# Altium schematic sheet 4_POW.schdoc.schdoc
size 309 x 223 mm; Symbol: Sheet-Symbol_A4; Device: Sheet-Symbol_A4; @Page Name: POW.Schematic1; @Create Date: 2023-10-28; @Page Count: 4; @Page No: 3; @Project Name: New Project_2023-10-25_23-03-02; @Schematic Name: Schematic1; @Update Date: 2023-11-27; Company: 嘉立创EDA; Page Size: A4; Version: V1.0; SheetNumber: 1; SheetTotal: 4
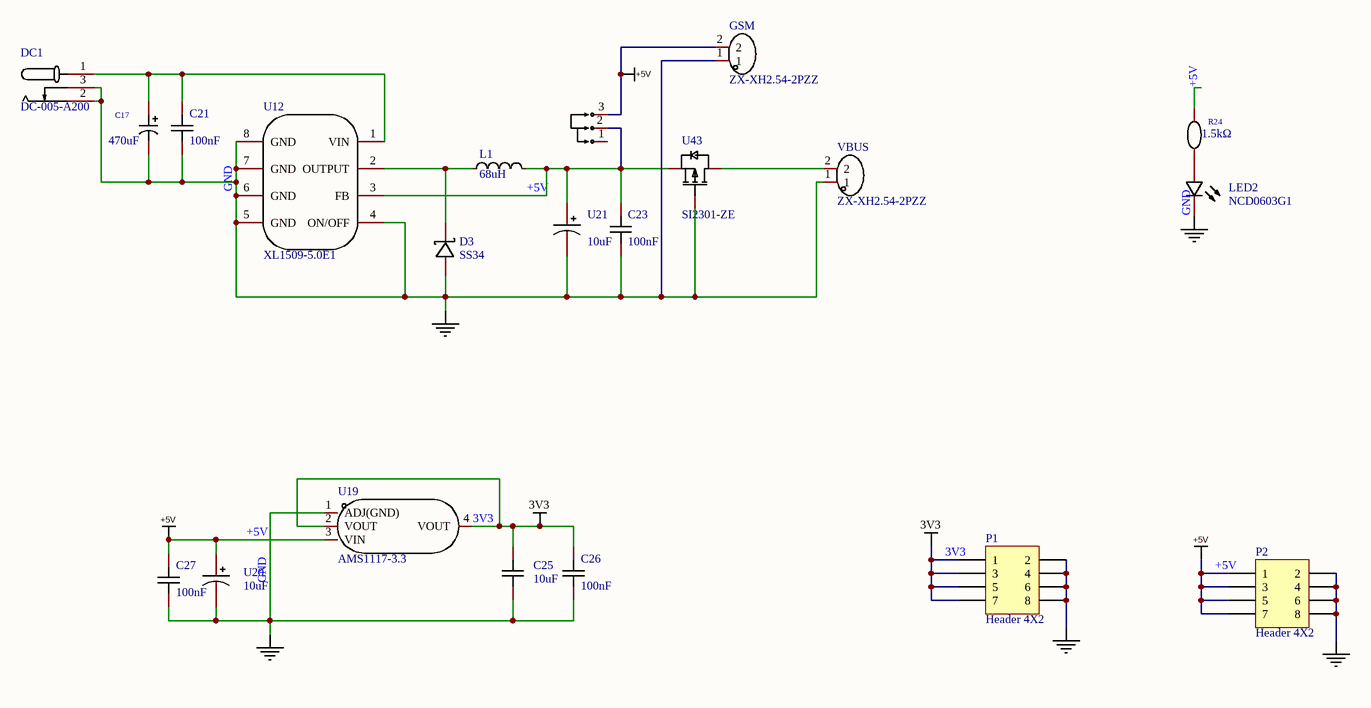
[diagram p0: 4_POW.schdoc.schdoc]

## Parts
C17  470uF  [CAP-SMD_BD6.3-L6.6-W6.6-LS7.6-RD]
C21  100nF  [C0603]
C23  100nF  [C0603]
C25  10uF  [C0603]
C26  100nF  [C0603]
C27  100nF  [C0603]
D3  SS34  [SMA_L4.3-W2.6-LS5.0-RD]
DC1  DC-005-A200  [DC-IN-TH_DC-005-A200]
GSM  ZX-XH2.54-2PZZ  [CONN-TH_2P-P2.50_HX25003-2A]
L1  68uH  [IND-SMD_L6.0-W6.0_SWPA6045S]
LED2  NCD0603G1  [LED0603-RD]
P1  Header 4X2  [HDR2X4]
P2  Header 4X2  [HDR2X4]
R24  1.5kΩ  [R0603]
SW??  SS12D10G4 071  [3PINSW]  (value not drawn)
U12  XL1509-5.0E1  [SOIC-8_L5.0-W4.0-P1.27-LS6.0-BL]
U19  AMS1117-3.3  [SOT-223-3_L6.5-W3.4-P2.30-LS7.0-BR]
U20  10uF  [CAP-TH_BD6.3-P2.50-D0.5-FD]
U21  10uF  [CAP-TH_BD6.3-P2.50-D0.5-FD]
U43  SI2301-ZE  [SOT-23-3_L2.9-W1.3-P1.90-LS2.4-BR]
VBUS  ZX-XH2.54-2PZZ  [CONN-TH_2P-P2.50_HX25003-2A]

## Nets
3V3: C25.2 C26.2 P1.1 P1.3 P1.5 P1.7 U19.2(VOUT) U19.4(VOUT)
+5V: C23.2 C27.2 GSM.2 L1.2 P2.1 P2.3 P2.5 P2.7 R24.2 SW??.2 SW??.3 U12.3(FB) U19.3(VIN) U20.1 U21.1 U43.2(S)
GND: C17.2 C21.1 C23.1 C25.1 C26.1 C27.1 D3.2(A) DC1.2 DC1.3 GSM.1 LED2.1(K) P1.2 P1.4 P1.6 P1.8 P2.2 P2.4 P2.6 P2.8 U12.4(ON/OFF) U12.5(GND) U12.6(GND) U12.7(GND) U12.8(GND) U19.1(ADJ(GND)) U20.2 U21.2 U43.1(G) VBUS.1
NetC17_1: C17.1 C21.2 DC1.1 U12.1(VIN)
NetD3_1: D3.1(K) L1.1 U12.2(OUTPUT)
NetLED2_2: LED2.2(A) R24.1
NetU43_3: U43.3(D) VBUS.2

Not connected (* = marked no-connect by the designer): SW?? 1

## Notes on the sheet
- 1
- 2
- 3
- 4
- 5
- 6
- A
- B
- C
- 原理图
- Schematic1
- 创建日期
- 更新日期
- 2023-10-28
- 2023-11-27
- 审阅
- 绘制
- 图页
- POW.Schematic1
- 物料编码
- New Project_2023-10-25_23-03-02
- D
- 版本
- 尺寸
- 页
- 共
- V1.0
- A4
- 嘉立创EDA

## Library data of the parts
C17 = RVT1C471M0607: 容值:470uF;精度:±20%;额定电压:16V;电容体直径:6.3mm;电容体长度:7.7mm;工作寿命:2000hrs@105℃;工作温度:-55℃~+105℃;; Manufacturer: ROQANG(容强); Add into BOM: yes; Tolerance: ±20%; Rated Voltage: 16V; φD: 6.3mm; L: 7.7mm; Name: 470uF; Symbol: RVT1C471M0607; Device: RVT1C471M0607; LCSC Part Name: 470uF ±20% 16V; Supplier Part: C2977552; Manufacturer Part: RVT1C471M0607; Supplier Footprint: SMD,6.3x7.7mm; JLCPCB Part Class: 扩展库; Supplier: LCSC; Convert to PCB: yes; Value: 470uF; Lifetime @ Temp: 2000hrs@105℃; Operating Temperature: -55℃~+105℃
C21 C23 C26 C27 = CGA3E3X8R1H104M080AE: 容值:100nF;精度:±20%;额定电压:50V;材质(温度系数):X8R;; Manufacturer: TDK; Add into BOM: yes; Tolerance: ±20%; Voltage Rated: 50V; Temperature Coefficient: X8R; Name: 100nF; Symbol: CGA3E3X8R1H104M080AE; Device: CGA3E3X8R1H104M080AE; LCSC Part Name: 100nF ±20% 50V; Supplier Part: C3855738; Manufacturer Part: CGA3E3X8R1H104M080AE; Supplier Footprint: 0603; Supplier: LCSC; Convert to PCB: yes; Value: 100nF
C25 = C1608X6S0J106M080AC: 容值:10uF;精度:±20%;额定电压:6.3V;材质(温度系数):X6S;; Manufacturer: TDK; Symbol: C1608X6S0J106M080AC_C314596-1; Add into BOM: yes; Tolerance: ±20%; Voltage Rated: 6.3V; Temperature Coefficient: X6S; Name: 10uF; Device: C1608X6S0J106M080AC; LCSC Part Name: 10uF ±20% 6.3V; Supplier Part: C314596; Manufacturer Part: C1608X6S0J106M080AC; Supplier Footprint: 0603; Datasheet: https://atta.szlcsc.com/upload/public/pdf/source/20221212/519F8C46C56E78A46759B3245CB4AD37.pdf; Supplier: LCSC; Convert to PCB: yes; Value: 10uF
D3 = SS34: Symbol: SS34_C9900023345; Add into BOM: yes; Name: SS34; Device: SS34; LCSC Part Name: SS34; Supplier Part: C9900023345; Manufacturer Part: SS34; Supplier Footprint: SMA,DO-214AC; JLCPCB Part Class: 扩展库; Datasheet: 2022-07-04/534833A/5ff3008f79ea4c6ab22b1f3463cee262/20210714020425519.pdf; Supplier: LCSC; Convert to PCB: yes
DC1 = DC-005-A200: DC-005 外径6.4 内芯2.0 3A电流 DC电源插座; Manufacturer: XUNPU(讯普); Add into BOM: yes; Name: DC-005-A200; Symbol: DC-005-A200; Device: DC-005-A200; LCSC Part Name: DC-005-A200; Supplier Part: C720557; Manufacturer Part: DC-005-A200; Supplier Footprint: 14×9.0×11.0mm; JLCPCB Part Class: 扩展库; Datasheet: https://atta.szlcsc.com/upload/public/pdf/source/20200812/C720557_2286DFCD6C75B71AF905731F627ABF3A.pdf; Supplier: LCSC; Convert to PCB: yes
GSM VBUS = ZX-XH2.54-2PZZ: 参考系列:XH;间距:2.54mm;插针结构:1x2P;排数:1;每排PIN数:2;行距:-;公母:公型插针;安装方式:直插;额定电流:3A;触头材质:黄铜;触头镀层:锡;工作温度范围:-25℃~+85℃;焊接温度(最大值):260℃;; Manufacturer: Megastar(兆星); Add into BOM: yes; Reference Series: XH; Pitch: 2.54mm; Pins Structure: 1x2P; Number of PINs Per Row: 2; Gender: 公型插针; Current Rating (Max): 3A; Welding Temperature (Max): 260℃; Name: ZX-XH2.54-2PZZ; Symbol: ZX-XH2.54-2PZZ; Device: ZX-XH2.54-2PZZ; LCSC Part Name: 系列:XH 间距:2.54mm 1x2P 直插; Supplier Part: C7429632; Manufacturer Part: ZX-XH2.54-2PZZ; Supplier Footprint: 插件,P=2.54mm; JLCPCB Part Class: 扩展库; Datasheet: https://atta.szlcsc.com/upload/public/pdf/source/20230619/19BA6947230AA44A04D3EDD65E618FD0.pdf; Supplier: LCSC; Convert to PCB: yes; Number of Rows: 1; Row Spacing: -; Mounting Style: 直插; Contact Material: 黄铜; Contact Plating: 锡; Operating Temperature Range: -25℃~+85℃
L1 = SWPA6045S680MT: 类型:-;电感值:68uH;精度:±20%;额定电流:1A;饱和电流(Isat):1.2A;; Manufacturer: Sunlord(顺络); Add into BOM: yes; Tolerance: ±20%; Rated Current: 1A; Saturation Current (Isat): 1.2A; DC Resistance (DCR): 289mΩ; Name: 68uH; Symbol: SWPA6045S680MT; Device: SWPA6045S680MT; LCSC Part Name: 68uH ±20% 1.2A; Supplier Part: C53663; Manufacturer Part: SWPA6045S680MT; Supplier Footprint: SMD; JLCPCB Part Class: 扩展库; Datasheet: https://atta.szlcsc.com/upload/public/pdf/source/20210916/AC798BA7E846B7D0B6818F45CD84DB0B.pdf; Supplier: LCSC; Convert to PCB: yes; Type: -; Value: 68uH; Ratings: -
LED2 = NCD0603G1: 发光颜色:翠绿色;功率:72mW;透镜颜色:无色透明;主波长:515nm~530nm;发光强度:330mcd~900mcd;发光角度:130°;工作温度:-30℃~+85℃;; Manufacturer: 国星光电; Symbol: FC-D1608UGK-520D10; Add into BOM: yes; Emitted Color: 翠绿色; Forward Voltage (VF): 2.6V~3.6V; Forward Current: 10mA; Power Dissipation: 72mW; Lens Color: 无色透明; Viewing Angle: 130°; Name: NCD0603G1; Device: NCD0603G1; LCSC Part Name: 翠绿 0603翠绿  正贴; Supplier Part: C84267; Manufacturer Part: NCD0603G1; Supplier Footprint: 0603; JLCPCB Part Class: 扩展库; Datasheet: https://atta.szlcsc.com/upload/public/pdf/source/20200820/C84267_04BA7703640BAC111D09F5EFB971FBF3.pdf; Supplier: LCSC; Convert to PCB: yes; Dominant Wavelength: 515nm~530nm; Luminous Intensity: 330mcd~900mcd; Operating Temperature: -30℃~+85℃
P1 P2 = Header 4X2: Header, 4-Pin, Dual row; LatestRevisionDate: 17-Jul-2002; LatestRevisionNote: Re-released for DXP Platform.; Publisher: Altium Limited
R24 = SCR0603F1K: 阻值:1.5kΩ;精度:±1%;; Manufacturer: VO(翔胜); Name: Value; Add into BOM: yes; Value: 1kΩ; Tolerance: ±1%; Symbol: SCR0603F1K; Device: SCR0603F1K; LCSC Part Name: 1kΩ ±1%; Supplier Part: C3016283; Manufacturer Part: SCR0603F1K; Supplier Footprint: 0603; JLCPCB Part Class: 扩展库; Datasheet: https://atta.szlcsc.com/upload/public/pdf/source/20220513/247AF9639BA21CF93567DC289CCC6A22.pdf; Supplier: LCSC; Convert to PCB: yes
SW?? = SS12D10G4 071: Manufacturer: SHOU HAN(首韩); Add into BOM: yes; Circuit: 单刀双掷; Pin Style: PC引脚; Switch Length: 12.7mm; Switch Width: 6.7mm; Switch Height: 6.4mm; Current Rating (DC): 2A; Voltage Rating (DC): 125V; Mechanical Life: 3千次; Symbol: SS12D10G4 071; Device: SS12D10G4 071; Supplier: LCSC; Supplier Part: C2887259; Manufacturer Part: SS12D10G4 071; JLCPCB Part Class: Extended Part; LCSC Part Name: SS12D10G4 071; Supplier Footprint: 插件; Datasheet: https://atta.szlcsc.com/upload/public/pdf/source/20210820/80D1704BBF3FCEE0435FCAA54C61E0A3.pdf; Convert to PCB: yes; Actuator Style: -; Mounting Style: 立插; Actuator Color: -; Current Rating (AC): -; Voltage Rating (AC): -; Operating Temperature: -16℃~+60℃
U12 = XL1509-5.0E1: 功能类型:降压型;输入电压:-;输出电流(最大值):-;; Manufacturer: XLSEMI(芯龙); Add into BOM: yes; Function: 降压型; Name: XL1509-5.0E1; Symbol: XL1509-5.0E1; Device: XL1509-5.0E1; LCSC Part Name: XL1509-5.0E1; Supplier Part: C61063; Manufacturer Part: XL1509-5.0E1; Supplier Footprint: SOP-8; JLCPCB Part Class: 基础库; Datasheet: https://atta.szlcsc.com/upload/public/pdf/source/20151126/1457707596805.pdf; Supplier: LCSC; Convert to PCB: yes; Synchronous Rectification: -; Number of Outputs: -; Topology: -; Input Voltage: -; Output Current (Max): -; Switching Frequency: -
U19 = AMS1117-3.3: 输出类型:固定;输出极性:正;输出通道数:1;最大输入电压:18V;输出电压:3.3V;压差:1.3V@(1A);输出电流:1A;电源纹波抑制比(PSRR):60dB@(120Hz);工作温度:±150℃@(Tj);; Manufacturer: YONGYUTAI(永裕泰); Symbol: AMS1117-3.3_C2891839; Add into BOM: yes; Output Type: 固定; Output Polarity: 正; Number of Outputs: 1; Maximum Input Voltage: 18V; Output Voltage: 3.3V; Name: AMS1117-3.3; Device: AMS1117-3.3; LCSC Part Name: 正 Vin=18V Vout=3.3V 1A 60dB@(120Hz); Supplier Part: C2891839; Manufacturer Part: AMS1117-3.3; Supplier Footprint: SOT-223-3; JLCPCB Part Class: 扩展库; Datasheet: https://atta.szlcsc.com/upload/public/pdf/source/20210901/A75ADDE6A17DEE0002F2A58A8D1F3634.pdf; Supplier: LCSC; Convert to PCB: yes; Dropout Voltage: 1.3V@(1A); Output Current: 1A; Power Supply Rejection Ratio (PSRR): 60dB@(120Hz); Operating Temperature: ±150℃@(Tj)
U20 U21 = ESK106M1HD11RRSNP-R: 容值:10uF;精度:±20%;额定电压:50V;纹波电流:-;等效串联电阻:-;; Manufacturer: MAN YUE(万裕科技); Add into BOM: yes; Tolerance: ±20%; Rated Voltage: 50V; φD: 5mm; L: 11mm; Name: 10uF; Symbol: ESK106M1HD11RRSNP-R; Device: ESK106M1HD11RRSNP-R; LCSC Part Name: 10uF ±20% 50V; Supplier Part: C3015490; Manufacturer Part: ESK106M1HD11RRSNP-R; Supplier Footprint: 插件; JLCPCB Part Class: 扩展库; Datasheet: https://atta.szlcsc.com/upload/public/pdf/source/20190724/C406799_CDF11B2185D3B9C175922EABD678815E.pdf; Supplier: LCSC; Convert to PCB: yes; Value: 10uF; Lead Spacing: -; Ripple Current: -; Equivalent Series Resistance(ESR): -; Lifetime @ Temp: -; Operating Temperature: -
U43 = SI2301-ZE: 漏源电压(Vdss):20V;连续漏极电流(Id):2.3A;功率(Pd):700mW;类型:P沟道;导通电阻(RDS(on)@Vgs,Id):126mΩ@4.5V;; Manufacturer: HXY MOSFET(华轩阳电子); Add into BOM: yes; Gate Threshold Voltage (Vgs(th)@Id): 1V@250uA; Drain Source Voltage (Vdss): 20V; Continuous Drain Current (Id): 2.3A; Power Dissipation (Pd): 700mW; Input Capacitance (Ciss@Vds): 285pF; Name: SI2301-ZE; Symbol: SI2301-ZE; Device: SI2301-ZE; LCSC Part Name: P沟道 耐压:20V 电流:2.3A; Supplier Part: C5261052; Manufacturer Part: SI2301-ZE; Supplier Footprint: SOT-23; JLCPCB Part Class: 扩展库; Datasheet: https://atta.szlcsc.com/upload/public/pdf/source/20230515/2FF2907841563ED329594D3237822724.pdf; Supplier: LCSC; Convert to PCB: yes; Type: P沟道; Drain Source On Resistance (RDS(on)@Vgs,Id): 126mΩ@4.5V